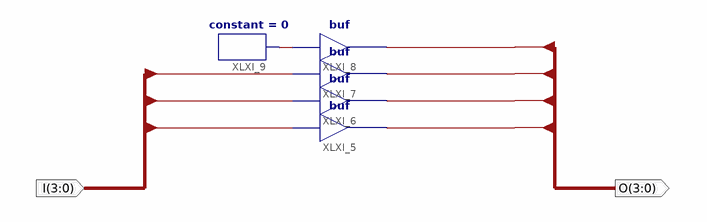
[diagram p0: schematic sheet 1]
// Xilinx ISE schematic Left_Shift.sch (virtex6) as structural Verilog: 5 symbols, 2 ports
module Left_Shift (
  input  [3:0] I,
  output [3:0] O
);

  wire XLXN_19;

  buf XLXI_5 (O[3], I[2]);
  buf XLXI_6 (O[2], I[1]);
  buf XLXI_7 (O[1], I[0]);
  buf XLXI_8 (O[0], XLXN_19);
  constant #(.CValue("0")) XLXI_9 (.O(XLXN_19));
endmodule
